# Altium schematic sheet buzzer.SchDoc
size A4
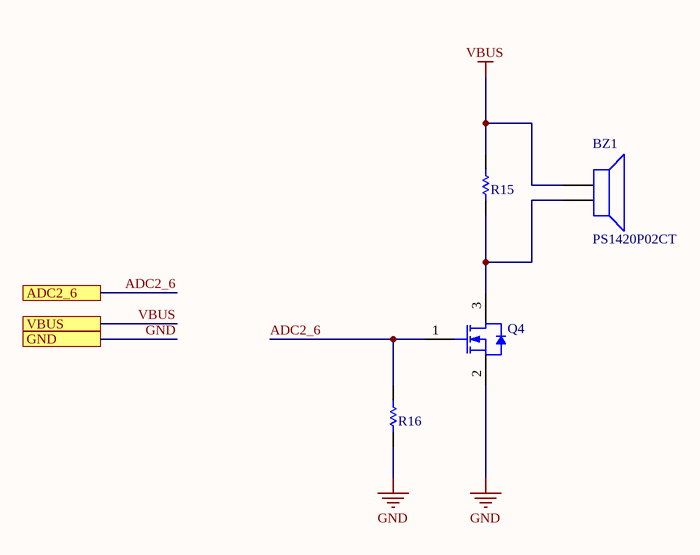
[diagram p0: buzzer.SchDoc]

## Parts
BZ1  PS1420P02CT  [Buzz_14mm]
Q4  BSS138-7-F  [DIOD-SOT23-3_V]  (value not drawn)
R15  ERJ-P06J102V  [RESC2013X70X40NL20T20]  (value not drawn)
R16  RK73B2ATTD103J  [RESC2013X60X30NL20T20]  (value not drawn)

## Ports
ADC2_6, GND, VBUS

## Nets
GND: Q4.2(S) R16.2 ; port GND
VBUS: BZ1.2 R15.2 ; port VBUS
ADC2_6: Q4.1(G) R16.1 ; port ADC2_6
NetBZ1_1: BZ1.1 Q4.3(D) R15.1

## Library data of the parts
BZ1 = PS1420P02CT: Buzzers Transducer, Externally Driven Piezo 5V 2kHz 70dB @ 5V, 10cm Through Hole PC Pins
Q4 = CMP-2000-04930-1: N-Channel Enhancement Mode Mosfet, 50 V, 0.2 A, -55 to 150 degC, 3-Pin SOT23, RoHS, Tape and Reel; Manufacturer: Diodes Inc; Brand: DiodesIncorporated; Unit Weight: 0.000282oz; Pd - Power Dissipation: 300mW; Id - Continuous Drain Current: 200mA; Rds On - Drain-Source Resistance: 3.5Ohms; Vgs - Gate-Source Voltage: 20V; Number of Channels: 1Channel; Vds - Drain-Source Breakdown Voltage: 50V; Transistor Type: 1N-Channel; Typical Turn-Off Delay Time: 20ns; Configuration: Single; Mounting Style: SMD/SMT; Height: 1mm; Package Description: 3-Pin Small Outline Transistor, Body 2.9 x 1.3 mm, Pitch 0.96 mm; Datasheet Version: Rev. 20-2, 11/2013; Minimum Operating Temperature: -55C; Package / Case: SOT-23-3; Channel Mode: Enhancement; Product: MOSFETSmallSignal; Packaging: Reel; Maximum Operating Temperature: +150C; Datasheet URL: https://datasheet.ciiva.com/8115/ds30144-8115344.pdf; Product Category: MOSFET; Width: 1.3mm; Technology: Si; Package Reference: SOT23-3; Manufacturer URL: http://www.diodes.com/; Transistor Polarity: N-Channel; Length: 2.9mm; Factory Pack Quantity: 3000; Series: BSS138; RoHS: True; Typical Turn-On Delay Time: 20ns
R15 = CMP-2001-00477-1: RES SMD 1K OHM 5% 1/2W 0805; Manufacturer: Panasonic; Part Number: ERJ-P06J102V
R16 = CMP-2001-04657-1: 10 kOhms ±5% 0.25W, 1/4W Chip Resistor 0805 (2012 Metric) Automotive AEC-Q200, Moisture Resistant Thick Film; Manufacturer: KOA Speer; Part Number: RK73B2ATTD103J